# EAGLE design 217_ambientlight (EAGLE 9.6.2)
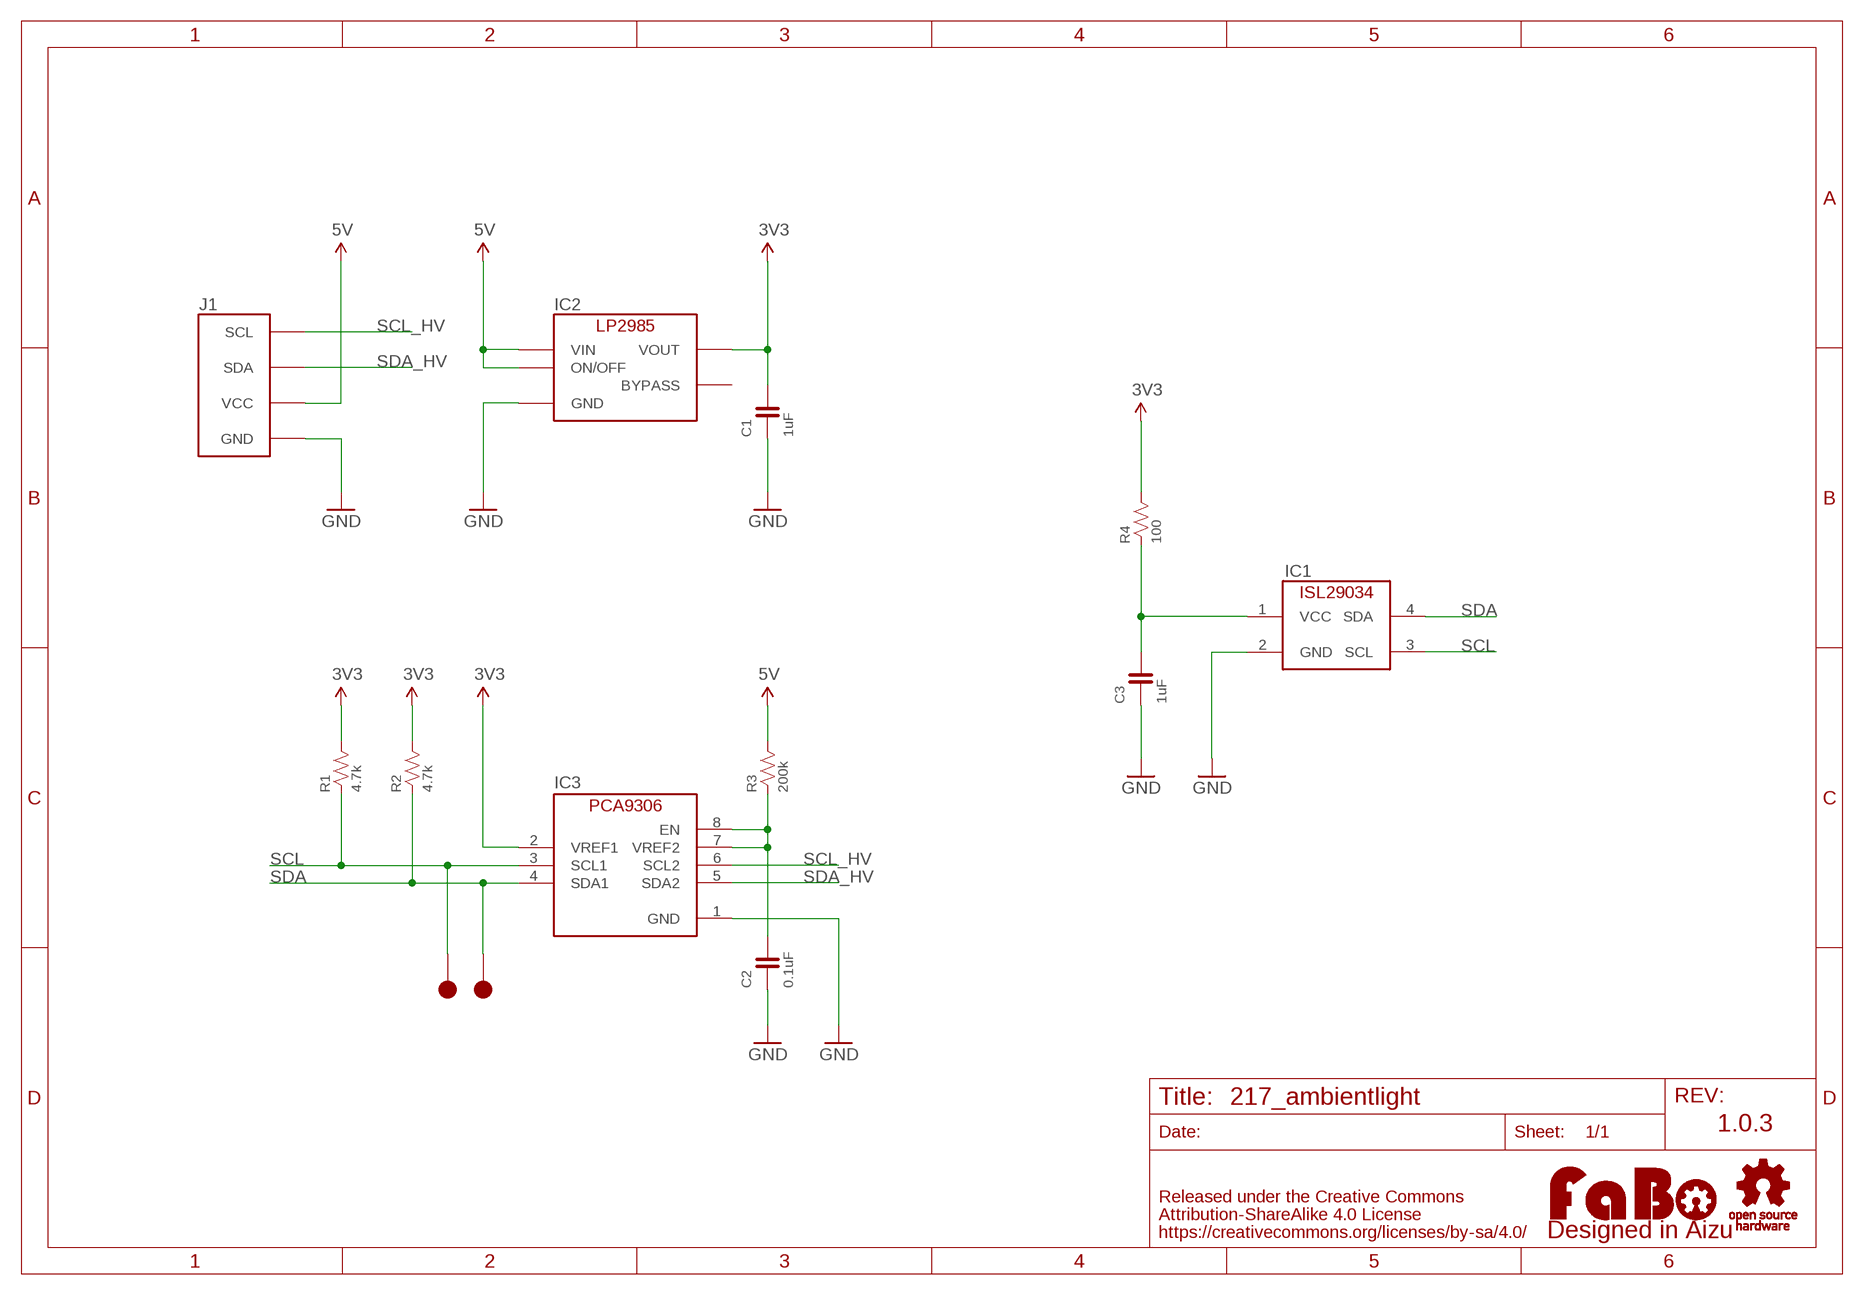
[diagram p0: schematic, sheet 1]

## Parts
C1  1uF  CAPACITOR-0603  [0603]
C2  0.1uF  CAPACITOR-0603  [0603]
C3  1uF  CAPACITOR-0603  [0603]
IC1  IN-ISL29034  [INTERSIL-ISL29034]
IC2  LP2985-33DBV  [SOT-23-5]
IC3  PCA9306GM  [XQFN8]
J1  FABO_BRICK_I2C  [FABO_BRICK_I2C]
LOGO1  LOGO_FABO-M  [LOGO_FABO_M]
R1  4.7k  RESISTOR-0603  [0603]
R2  4.7k  RESISTOR-0603  [0603]
R3  200k  RESISTOR-0603  [0603]
R4  100  RESISTOR-0603  [0603]
TP1  TP-15  [TP-15]
TP2  TP-15  [TP-15]
U$2  LOGO_OSHW-M_BOTTOM  [LOGO_OSHW_M_BOTTOM]

## Nets
3V3: C1.2 IC2.5(VOUT) IC3.2(VREF1) R1.2 R2.2 R4.2
5V: IC2.1(VIN) IC2.3(ON/OFF) J1.VCC R3.2
GND: C1.1 C2.1 C3.1 IC1.2(GND) IC2.2(GND) IC3.1(GND) J1.GND
N$2: C2.2 IC3.7(VREF2) IC3.8(EN) R3.1
SCL: IC1.3(SCL) IC3.3(SCL1) R1.1 TP2.1
SCL_HV: IC3.6(SCL2) J1.SCL
SDA: IC1.4(SDA) IC3.4(SDA1) R2.1 TP1.1
SDA_HV: IC3.5(SDA2) J1.SDA
VCC: C3.2 IC1.1(VCC) R4.1
Unconnected: IC2.4(BYPASS)

## Notes on the sheet
- 1.0.3

## Library data of the parts
C1-C3 = FaBo-Capacitor:CAPACITOR: CAPACITOR
IC1 = FaBo-Mems:IN-ISL29034
IC2 = FaBo-Supply:LP2985: LP2985
IC3 = FaBo-LevelTranslator:PCA9306
J1 = FaBo-Template:FABO_BRICK_I2C: FaBo Brick I2C
LOGO1 = component:LOGO_FABO
R1-R4 = FaBo-Resistors:RESISTOR: RESISTOR
TP1 TP2 = FaBo-Supply:TP
U$2 = FaBo-etc:LOGO_OSHW

## Board
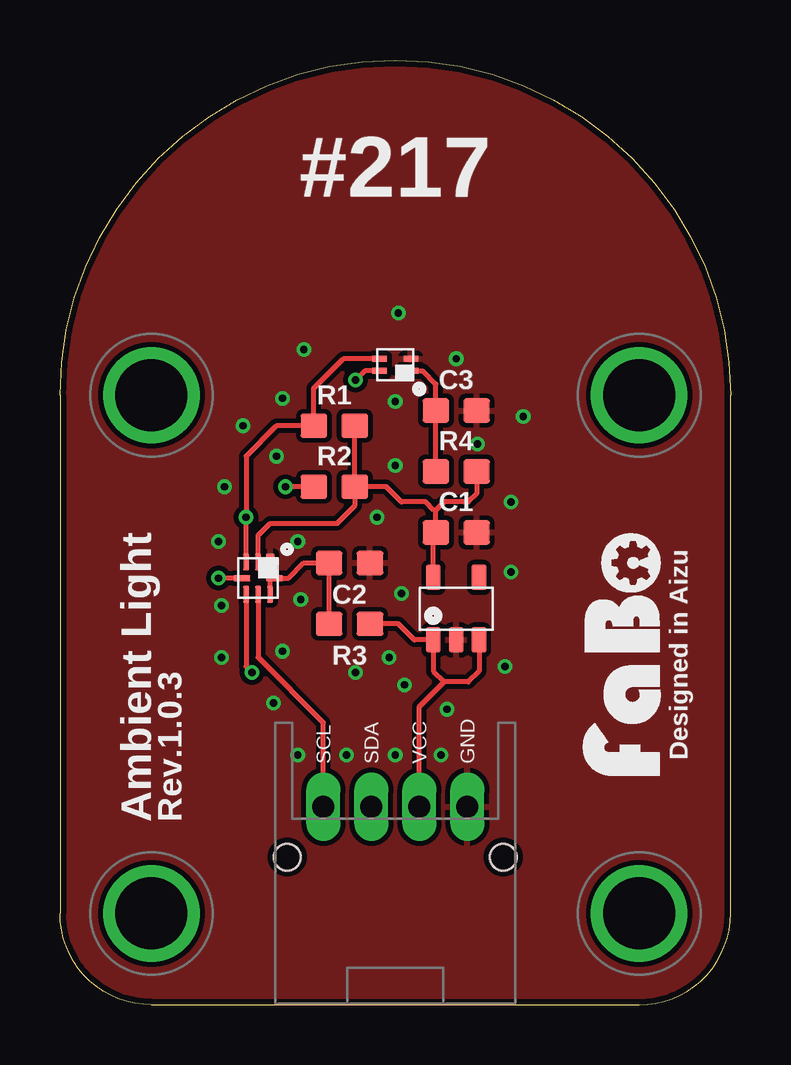
[diagram p1: board, top side]
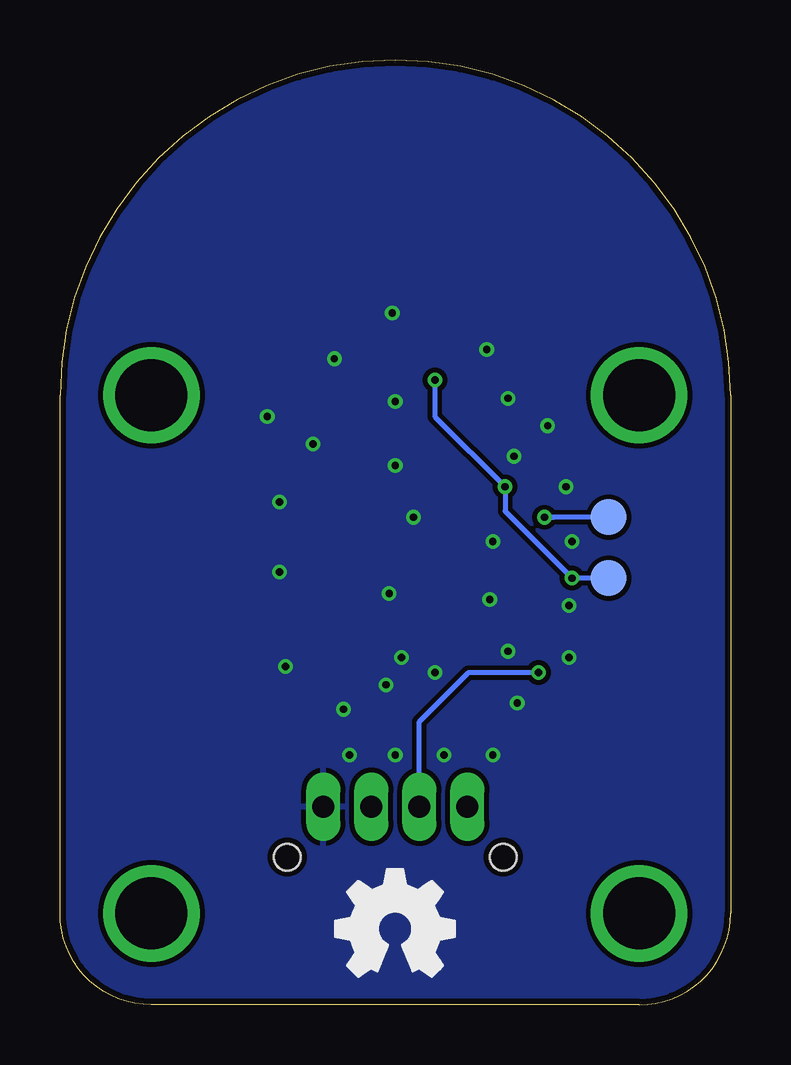
[diagram p2: board, bottom side, seen from below]

Size 27.94 x 39.37 mm. Coordinates in mm from the lower left corner, seen from the top.
Copper layers (1*16): Top 0.035mm / dielectric 1.6mm / Bottom 0.035mm
Design rules "PCBway": minimum track width 6mil, minimum drill 12mil, track to track 6mil, track to pad 6mil, pad to pad 6mil, via to via 6mil, smd to smd 6mil, copper to edge 10mil, drill to drill 10mil, minimum pad ring 10mil, minimum via ring 6mil, stop-mask expansion 2mil, vias tented up to drill 100mil, thermal gap 8mil

### Footprints (pad centres in the part's own frame; a part is rotated, then mirrored left to right if it is on the bottom)
0603 = smd 1.1 x 1: 1 -0.85,0; 2 0.85,0
INTERSIL-ISL29034 = smd 0.75 x 0.25: 1 -0.575,0.25 | smd 0.6 x 0.25: 2 -0.65,-0.25; 3 0.65,-0.25; 4 0.65,0.25
SOT-23-5 = smd 0.6 x 1.05: 1 -0.95,-1.3; 2 0,-1.3; 3 0.95,-1.3; 4 0.95,1.3; 5 -0.95,1.3
XQFN8 = smd 0.7 x 0.35: 1 -0.675,0.5 | smd 0.7 x 0.25: 2 -0.675,0; 3 -0.675,-0.5; 5 0.675,-0.5; 6 0.675,0; 7 0.675,0.5 | smd 0.25 x 0.7: 4 0,-0.675; 8 0,0.675
FABO_BRICK_I2C = drill 0.9 pad 1.422 long: GND 3,-10.795; SCL -3,-10.795; SDA -1,-10.795; VCC 1,-10.795 | drill 3 pad 3.81: P$1 -10.16,6.35; P$2 10.16,6.35; P$3 -10.16,-15.24; P$4 10.16,-15.24 | hole 1.1: -4.5,-12.895; 4.5,-12.895
TP-15 = smd 1.5 x 1.5: 1 0,0

### Placement (x,y rotation side)
C1  16.51,19.68 180 top
C2  12.06,18.41 180 top
C3  16.51,24.77 180 top
IC1  13.97,26.67 180 top
IC2  16.51,16.51 0 top
IC3  8.26,17.78 270 top
J1  13.97,19.05 0 top
LOGO1  25.4,14.61 90 top
R1  11.43,24.13 0 top
R2  11.43,21.59 0 top
R3  12.06,15.88 0 top
R4  16.51,22.23 0 top
TP1  5.08,17.78 0 bottom
TP2  5.08,20.32 0 bottom
U$2  13.97,3.17 0 top

### Tracks (layer width: path | path; a pad name or v marks a point on that pad's centre or on a via)
3V3
  Top 0.203: IC2.5 15.56,19.59 C1.2 15.66,20.61 | 15.66,20.61 16,20.95 17.02,20.95 17.36,21.3 R4.2 | 15.66,20.61 15.58,20.61 15.24,20.95 14.22,20.95 13.59,21.59 R2.2 | IC3.2 8.26,19.56 8.76,20.07 11.56,20.07 12.28,20.79 R2.2 | R2.2 R1.2
5V
  Top 0.203: 16,13.46 15.56,13.9 IC2.1 14.76,15.21 14.1,15.88 R3.2 | IC2.3 17.46,13.9 17.02,13.46 16,13.46 | J1.VCC 14.97,12.43 16,13.46
GND  (via drill 0.3)
  other vias: 13.97,25.15 13.97,22.48 9.02,22.86 7.62,24.13 9.27,25.27 10.16,27.3 14.1,28.83 16.51,26.92 19.3,24.51 17.4,23.37 18.8,20.95 18.8,18.03 13.21,20.32 18.54,14.1 16.13,12.32 15.88,10.41 13.97,10.41 11.94,10.41 9.91,10.41 8.89,12.57 9.27,14.73 13.72,14.48 14.35,13.34 14.22,17.14 10.03,16.89 9.91,19.3 6.73,16.64 6.73,14.48 6.6,19.3 6.86,21.59 12.32,13.84
  pour Bottom (isolate 0.203): 0,0 27.94,0 27.94,39.37 0,39.37
  pour Top (isolate 0.203): 0,0 27.94,0 27.94,39.37 0,39.37
N$2
  Top 0.203: IC3.7 8.76,17.78 IC3.8 9.53,17.78 10.16,18.41 C2.2 R3.1
SCL  (via drill 0.3)
  Top 0.203: IC1.3 11.81,26.92 10.58,25.69 R1.1 9.02,24.13 7.75,22.87 v7.75,20.33 v7.75,20.32 v7.75,20.31 IC3.3
  Bottom 0.203: 7.37,20.32 v7.75,20.32 TP2.1
SCL_HV
  Top 0.203: IC3.6 8.26,14.48 10.97,11.76 J1.SCL
SDA  (via drill 0.3)
  Top 0.203: IC1.4 12.7,26.42 v12.32,26.04 | R2.1 v9.4,21.59 | IC3.4 v6.6,17.78
  Bottom 0.203: v12.32,26.04 12.32,24.51 v9.4,21.59 9.4,20.57 v6.6,17.78 TP1.1
SDA_HV  (via drill 0.3)
  Top 0.203: IC3.5 7.75,14.09 v8,13.84
  Bottom 0.203: v8,13.84 10.92,13.84 12.97,11.79 J1.SDA
VCC
  Top 0.203: R4.1 C3.2 15.66,25.87 15.11,26.42 IC1.1

### Text on the board
tPlace: #217 | Designed in Aizu | Ambient Light | Rev.1.0.3